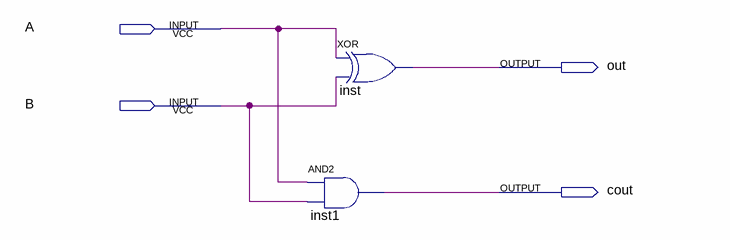
[diagram p0: schematic sheet]
// Quartus schematic half_adder.bdf as structural Verilog: 2 symbols, 4 pins
module half_adder (
  input  A,
  input  B,
  output out,
  output cout
);

  and inst1 (cout, A, B);
  xor inst (out, A, B);
endmodule
